# Altium schematic sheet Memory.SchDoc: Titel
size A3; ApprovedBy: name; CompanyName: DCI Electronics bv; DrawnBy: KRS; Address1: Nijverheidsstraat 14; Address2: 4458 AV Eindewege; Address3: Phone: +31 (0)113 344880; DocumentNumber: 9; Revision: 1; SheetNumber: 9; SheetTotal: 14; PageSetup: Record=PageOptions|CenterHorizontal=True|CenterVertical=True|PrintScale=1.00|XCorrection=1.00|YCorrection=1.00|PrintKind=1|BorderSize=5000000|LeftOffset=0|BottomOffset=0|Orientation=2|PaperLength=1000|PaperWidth=1000|Scale=100|PaperSource=7|PrintQuality=-4|MediaType=1|DitherType=10|PaperKind=ISO_A4_(210.00_x_297.00_MM)|PrintScaleMode=1; SubTitle: SubTitel; ApprovedDate: 01-01-12
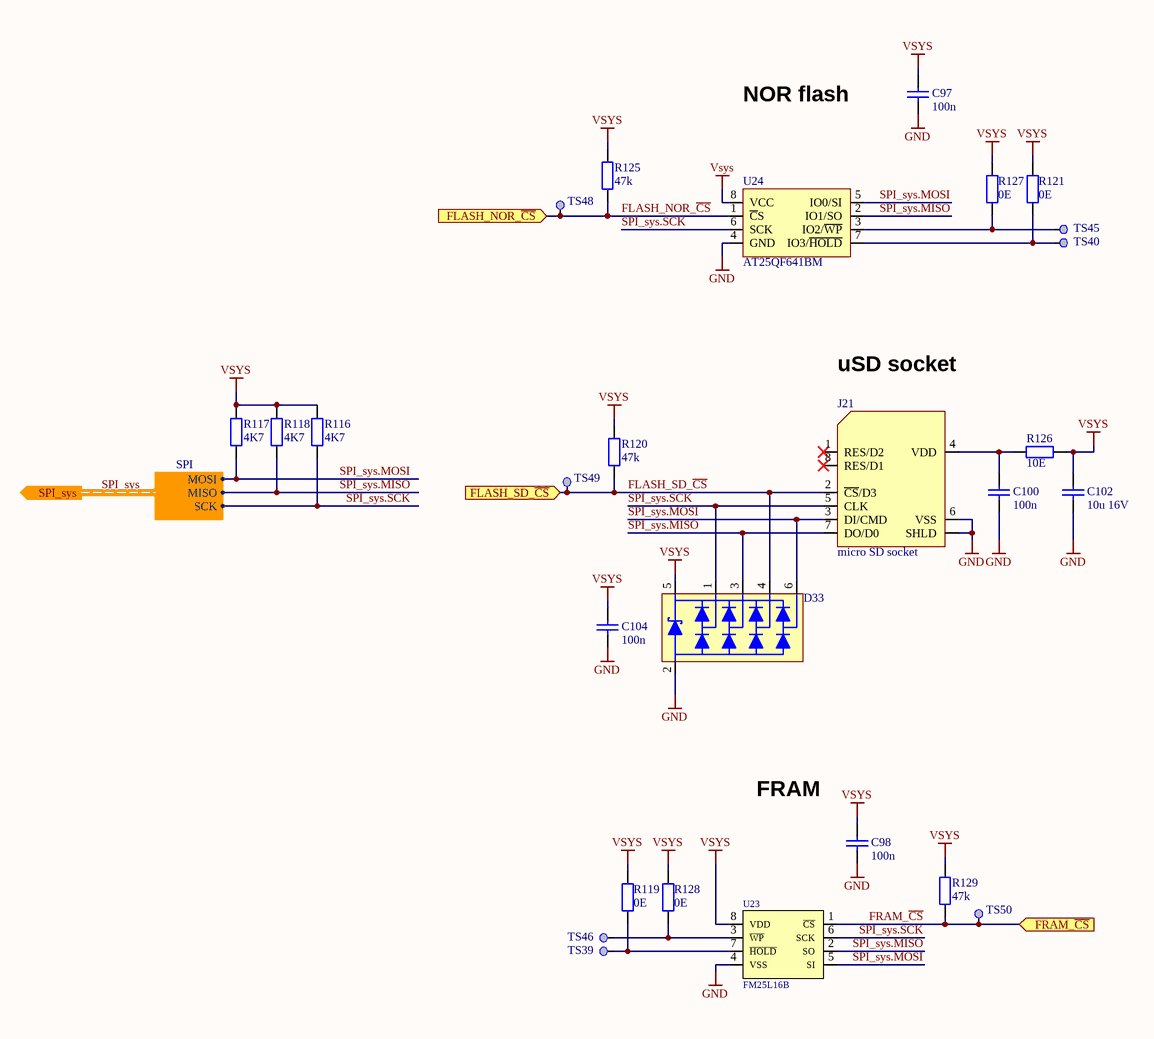
[diagram p0: Memory.SchDoc]

## Parts
C97  100n  [CAPC1608X09N]
C98  100n  [CAPC1608X09N]
C100  100n  [CAPC1608X09N]
C102  10u 16V  [CAPC1608X09N]
C104  100n  [CAPC1608X09N]
D33  (no value)  [SOT95P280X145-6N]
J21  micro SD socket  [CON-170G000-009]
R116  4K7  [RESC1005x04N]
R117  4K7  [RESC1005x04N]
R118  4K7  [RESC1005x04N]
R119  0E  [RESC1005X04N]
R120  47k  [RESC1608X13N]
R121  0E  [RESC1005X04N]
R125  47k  [RESC1608X13N]
R126  10E  [RESC1608X13N]
R127  0E  [RESC1005X04N]
R128  0E  [RESC1005X04N]
R129  47k  [RESC1608X13N]
TS39  TESTPAD  [TESTPAD 2MM]  (value not drawn)  (no BOM)
TS40  TESTPAD  [TESTPAD 2MM]  (value not drawn)  (no BOM)
TS45  TESTPAD  [TESTPAD 2MM]  (value not drawn)  (no BOM)
TS46  TESTPAD  [TESTPAD 2MM]  (value not drawn)  (no BOM)
TS48  TESTPAD  [TESTPAD 2MM]  (value not drawn)  (no BOM)
TS49  TESTPAD  [TESTPAD 2MM]  (value not drawn)  (no BOM)
TS50  TESTPAD  [TESTPAD 2MM]  (value not drawn)  (no BOM)
U23  FM25L16B  [SOP-120g001-008]
U24  AT25QF641BM  [SON127P500X600X60-9N]

## Ports
FLASH_NOR_~{CS} (in), FLASH_SD_~{CS} (in), FRAM_~{CS} (in), SPI_sys (out, harness SPI)

## Harnesses
SPI: SCK, MISO, MOSI

## Nets
GND: C97.1 C98.1 C100.1 C102.1 C104.1 D33.2(A) J21.6(VSS) J21.SHLD U23.4(VSS) U24.4(GND)
VSYS: C97.2 C98.2 C102.2 C104.2 D33.5(A) R116.2 R117.2 R118.2 R119.2 R120.2 R121.2 R125.2 R126.1 R127.2 R128.2 R129.2 U23.8(VDD) U24.8(VCC)
FLASH_NOR_~{CS}: R125.1 TS48.1(TP) U24.1(~{C}S) ; port FLASH_NOR_~{CS}
FLASH_SD_~{CS}: D33.4(A) J21.2(~{CS}/D3) R120.1 TS49.1(TP) ; port FLASH_SD_~{CS}
FRAM_~{CS}: R129.1 TS50.1(TP) U23.1(~{CS}) ; port FRAM_~{CS}
SPI_sys.MISO: D33.3(A) J21.7(DO/D0) R118.1 U23.2(SO) U24.2(IO1/SO) ; port SPI_sys.MISO
SPI_sys.MOSI: D33.6(A) J21.3(DI/CMD) R117.1 U23.5(SI) U24.5(IO0/SI) ; port SPI_sys.MOSI
SPI_sys.SCK: D33.1(A) J21.5(CLK) R116.1 U23.6(SCK) U24.6(SCK) ; port SPI_sys.SCK
NetC100_2: C100.2 J21.4(VDD) R126.2
NetR119_1: R119.1 TS39.1(TP) U23.7(~{HOLD})
NetR121_1: R121.1 TS40.1(TP) U24.7(IO3/~{HOLD})
NetR127_1: R127.1 TS45.1(TP) U24.3(IO2/~{WP})
NetR128_1: R128.1 TS46.1(TP) U23.3(~{WP})

Not connected (* = marked no-connect by the designer): J21 1(RES/D2)* 8(RES/D1)*

## Buses and harness runs
harness SPI_sys = port SPI_sys

## Notes on the sheet
- NOR flash
- uSD socket
- FRAM
- Designed by:
- Drawing number:
- Variant:
- Date:
- Page:
- Rev:
- Of:
- Dekimo Goes B.V.
- Nijverheidsstraat 14, 4458 AV  Eindewege, Phone: +31 (0)113 344880

## Library data of the parts
C97 C98 C100 C104 = CKE 100N/60: 100nF 50V 10% X7R; EngPartGrpMainCode: CAP; ManufactpartCode: 2238 586 15649-PHI; Type: Capacitor ceramic SMD; Preferred: False; SMD_Flag: True; PartCode: CKE 100N/60
C102 = CKE 10UV16/60: 10uF 16V ±10% X5R; EngPartGrpMainCode: CAP; ManufactpartCode: GRM188R61C106KAALD-MUR; Type: Capacitor ceramic SMD; Preferred: False; SMD_Flag: True; PartCode: CKE 10UV16/60
D33 = DIO SRV05-4: quadruple  Hi speed clamp,5V; EngPartGrpMainCode: DIO; ManufactpartCode: SRV05-4.TCT -SEM; Type: TVS diode array SMD; Preferred: False; SMD_Flag: True; PartCode: DIO SRV05-4
J21 = CON SD/15: micro SD card hinged; EngPartGrpMainCode: CONN; ManufactpartCode: MEM2067-02-180-00-A-GCT; Preferred: False; SMD_Flag: True; PartCode: CON SD/15; Type: Connector SD/MMC SMD
R116-R118 = R 4K7/70: 4K7, 62.5mW, 1%; EngPartGrpMainCode: RES; ManufactpartCode: RC0402FR-074K7L-YAG; Preferred: False; SMD_Flag: True; PartCode: R 4K7/70; Type: Resistor metalfilm SMD
R119 R121 R127 R128 = R 0E/70: 0E, 62.5mW, 1%; PartCode: R 0E/70; EngPartGrpMainCode: RES; ManufactpartCode: RC0402JR-070RL-YAG; Preferred: False; SMD_Flag: True; Type: Resistor metalfilm SMD
R120 R125 R129 = R 47K/60: 47k 100mW 1%; EngPartGrpMainCode: RES; ManufactpartCode: RC0603FR-0747KL-YAG; Preferred: False; SMD_Flag: True; PartCode: R 47K/60; Type: Resistor metalfilm SMD
R126 = R 10E/60: 10E 0.1W 1%; EngPartGrpMainCode: RES; ManufactpartCode: RC0603FR-0710RL-YAG; Preferred: False; SMD_Flag: True; PartCode: R 10E/60; Type: Resistor metalfilm SMD
TS39 TS40 TS45 TS46 TS48-TS50 = TESTPAD-2.0: 0.5mm Testpad SMD; PartCode: TESTPAD-2.0
U23 = IC FM25L16B: 16k, SPI, FRAM; EngPartGrpMainCode: IC; ManufactpartCode: FM25L16B-GTR-INF; Preferred: False; SMD_Flag: True; PartCode: IC FM25L16B; Type: IC EEPROM smd
U24 = IC AT25QF641BM: AT25QF641b 64Mbit dataflash; EngPartGrpMainCode: IC; ManufactpartCode: AT25QF641B-MHB-T-ADE; Preferred: False; SMD_Flag: True; PartCode: IC AT25QF641BM; Type: IC Flash SMD